# Altium schematic sheet Supply.SchDoc
size A4
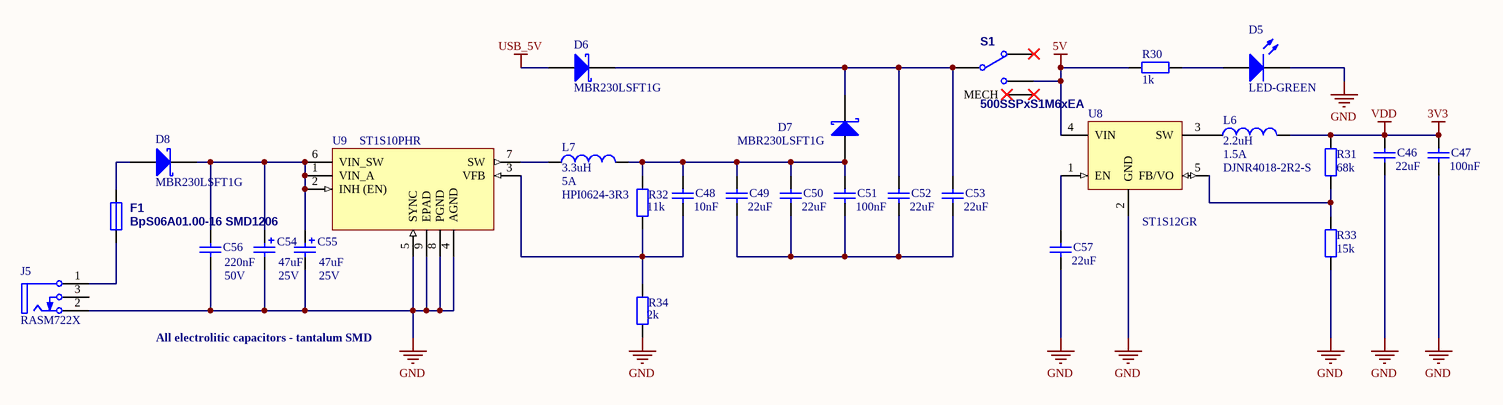
[diagram p0: Supply.SchDoc]

## Parts
C46  value 22uF  [C1206]  (hidden comment: Cap)
C47  value 100nF  [C1206]  (hidden comment: Cap)
C48  value 10nF  [C1206]  (hidden comment: Cap)
C49  value 22uF  [C1206]  (hidden comment: Cap)
C50  value 22uF  [C1206]  (hidden comment: Cap)
C51  value 100nF  [C1206]  (hidden comment: Cap)
C52  value 22uF  [C1206]  (hidden comment: Cap)
C53  value 22uF  [C1206]  (hidden comment: Cap)
C54  25V  value 47uF  [SMDB]
C55  25V  value 47uF  [SMDB]
C56  50V  value 220nF  [C1206]
C57  value 22uF  [C1206]  (hidden comment: Cap)
D5  LED-GREEN  [LED0603G]
D6  MBR230LSFT1G  [SMB]
D7  MBR230LSFT1G  [SMB]
D8  MBR230LSFT1G  [SMB]
F1  BpS06A01.00-16 SMD1206  [F1206]
J5  RASM722X  [SWIT-RASM722X_V]
L6  DJNR4018-2R2-S  value 2.2uH  Value2: 1.5A  [L2220_3]
L7  HPI0624-3R3  value 3.3uH  Value2: 5A  [DE0703]
R30  value 1k  [6-0805_L]  (hidden comment: Res2)
R31  value 68k  [6-0805_L]  (hidden comment: Res2)
R32  value 11k  [6-0805_L]  (hidden comment: Res2)
R33  value 15k  [6-0805_L]  (hidden comment: Res2)
R34  value 2k  [6-0805_L]  (hidden comment: Res2)
S1  500SSPxS1M6xEA  [500SSPxS1M6xEA]
U8  ST1S12GR  [TSOT23-5L_L]
U9  ST1S10PHR  [HSO-8_L]

## Nets
3V3: C46.2 C47.2 L6.2 R31.2  [also labelled VDD]
5V: R30.1 S1.3 U8.4(VIN)
GND: C46.1 C47.1 C54.2 C55.2 C56.1 C57.1 D5.2(K) J5.2(TIP) R33.1 R34.1 U8.2(GND) U9.4(AGND) U9.5(SYNC) U9.8(PGND) U9.9(EPAD)
USB_5V: D6.1(A)
NetC48_1: C48.1 R32.1 R34.2 U9.3(VFB)
NetC48_2: C48.2 C49.2 C50.2 C51.2 D7.1(A) L7.2 R32.2
NetC49_1: C49.1 C50.1 C51.1 C52.1 C53.1
NetC52_2: C52.2 C53.2 D6.2(K) D7.2(K) S1.2
NetC54_1: C54.1 C55.1 C56.2 D8.2(K) U9.1(VIN_A) U9.2(INH_(EN)) U9.6(VIN_SW)
NetC57_2: C57.2 U8.1(EN)
NetD5_1: D5.1(A) R30.2
NetD8_1: D8.1(A) F1.2
NetF1_1: F1.1 J5.1(SLEEVE)
NetL6_1: L6.1 U8.3(SW)
NetL7_1: L7.1 U9.7(SW)
NetR31_1: R31.1 R33.2 U8.5(FB/VO)

Not connected (* = marked no-connect by the designer): J5 3(SHUNT); S1 1* M(MECH)*

## Notes on the sheet
- All electrolitic capacitors - tantalum SMD

## Library data of the parts
C46-C53 C56 C57 = Cap: Capacitor; Published: 8-Jun-2000; LatestRevisionDate: 17-Jul-2002; LatestRevisionNote: Re-released for DXP Platform.; PackageReference: RAD-0.3; Publisher: Altium Limited; PackageDescription: Radial Cap, Thru-Hole; 2 Leads; 0.3 in Pin Spacing
C54 C55 = Cap Pol2: Polarized Capacitor (Axial); Published: 8-Jun-2000; LatestRevisionDate: 17-Jul-2002; LatestRevisionNote: Re-released for DXP Platform.; PackageReference: POLAR0.8; Publisher: Altium Limited; PackageDescription: Polarized Capacitor; 2 Leads
D5 = LED0: Typical INFRARED GaAs LED; Published: 8-Jun-2000; LatestRevisionDate: 08-Jul-2005; LatestRevisionNote: Mech Layer 1 removed.; PackageReference: LED-0; Publisher: Altium Limited; PackageDescription: LED; 2 Leads
D6-D8 = D Schottky: Schottky Diode; Published: 8-Jun-2000; LatestRevisionDate: 17-Jul-2002; LatestRevisionNote: Re-released for DXP Platform.; PackageReference: SMB; Publisher: Altium Limited; PackageDescription: DO-214-AA/SMB; 2 C-Bend Leads; Body 5.3 x 3.6 mm, inc. leads (LxW); Code_JEDEC: DO-214-AA
F1 = 1206 Fuse: Published: 8-Jun-2000; LatestRevisionDate: 17-Jul-2002; LatestRevisionNote: Re-released for DXP Platform.; PackageReference: PIN-W2/E2.8; Publisher: Altium Limited; PackageDescription: Thru-Hole; 2 Leads
J5 = JACK-2CD3-TN: Power Jack, 5 A, 250 V, 3-Pin SMD, RoHS, Bulk; ComponentLink1URL: http://www.switchcraft.com/; ComponentLink2URL: http://www.switchcraft.com/Drawings/rasm732x_cd.pdf; ComponentLink1Description: Manufacturer URL; PackageReference: RASM722X; ComponentLink2Description: Datasheet; DatasheetVersion: Rev. A, 09/2005; PackageDescription: 3-Pin Surface Mount Device, Body 14.5 x 9 mm
L6 L7 = Inductor: Code_IEC: 1005; Published: 8-Jun-2000; LatestRevisionDate: 29-May-2009; LatestRevisionNote: IPC-7351 Footprint Added.; PackageReference: 0402-A; Publisher: Altium Limited; PackageDescription: Chip Inductor; Code_JEITA: 0402
R30-R34 = Res2: Resistor; Published: 8-Jun-2000; LatestRevisionDate: 17-Jul-2002; LatestRevisionNote: Re-released for DXP Platform.; PackageReference: AXIAL-0.4; Publisher: Altium Limited; PackageDescription: Axial Device, Thru-Hole; 2 Leads; 0.4 in Pin Spacing
S1 = 500SSPxS1M6xEA: E-Switches SPDT AC: 3A/250V, DC: 6A/28V; Supplier 1: Digi-Key; Supplier Part Number 1: EG2478-ND
U8 = PM-SWREG-ST1S12G-IL5: Synchronous rectification with inhibit, 0.7 A, 1.7 MHz adjustable, step-down switching regulator, 5-Pin TSOT, Tape and Reel; ComponentLink1Description: Manufacturer URL; PackageVersion: 2011; ComponentLink2Description: Datasheet; PackageDescription: 5-Pin SOT-23 Package, 2.9 x 1.6 mm Body, 0.95 mm Pitch, 2.8 mm Lead Span; ComponentLink1URL: http://www.st.com; PackageReference: TSOT23-5L; ComponentLink2URL: http://www.st.com/internet/com/TECHNICAL_RESOURCES/TECHNICAL_LITERATURE/DATASHEET/CD00181873.pdf; DatasheetVersion: Jun-2011
U9 = PM-REG-ST1S10-IL9: Monolithic synchronous step-down regulator, 8-Pin HSOP, Tape and Reel; ComponentLink2Description: Datasheet; PackageDescription: 8-Pin Small Outline Integrated Circuit 1.27 mm Pitch; ComponentLink2URL: http://www.st.com/internet/com/TECHNICAL_RESOURCES/TECHNICAL_LITERATURE/DATASHEET/CD00169322.pdf; ComponentLink1Description: Manufacturer URL; PackageVersion: 2007; DatasheetVersion: Mar-2011; PackageReference: HSO-8; ComponentLink1URL: http://www.st.com